# EAGLE design PygmyWEB_Performance_V1p1 (EAGLE 5.10)

## Sheet 1 of 6
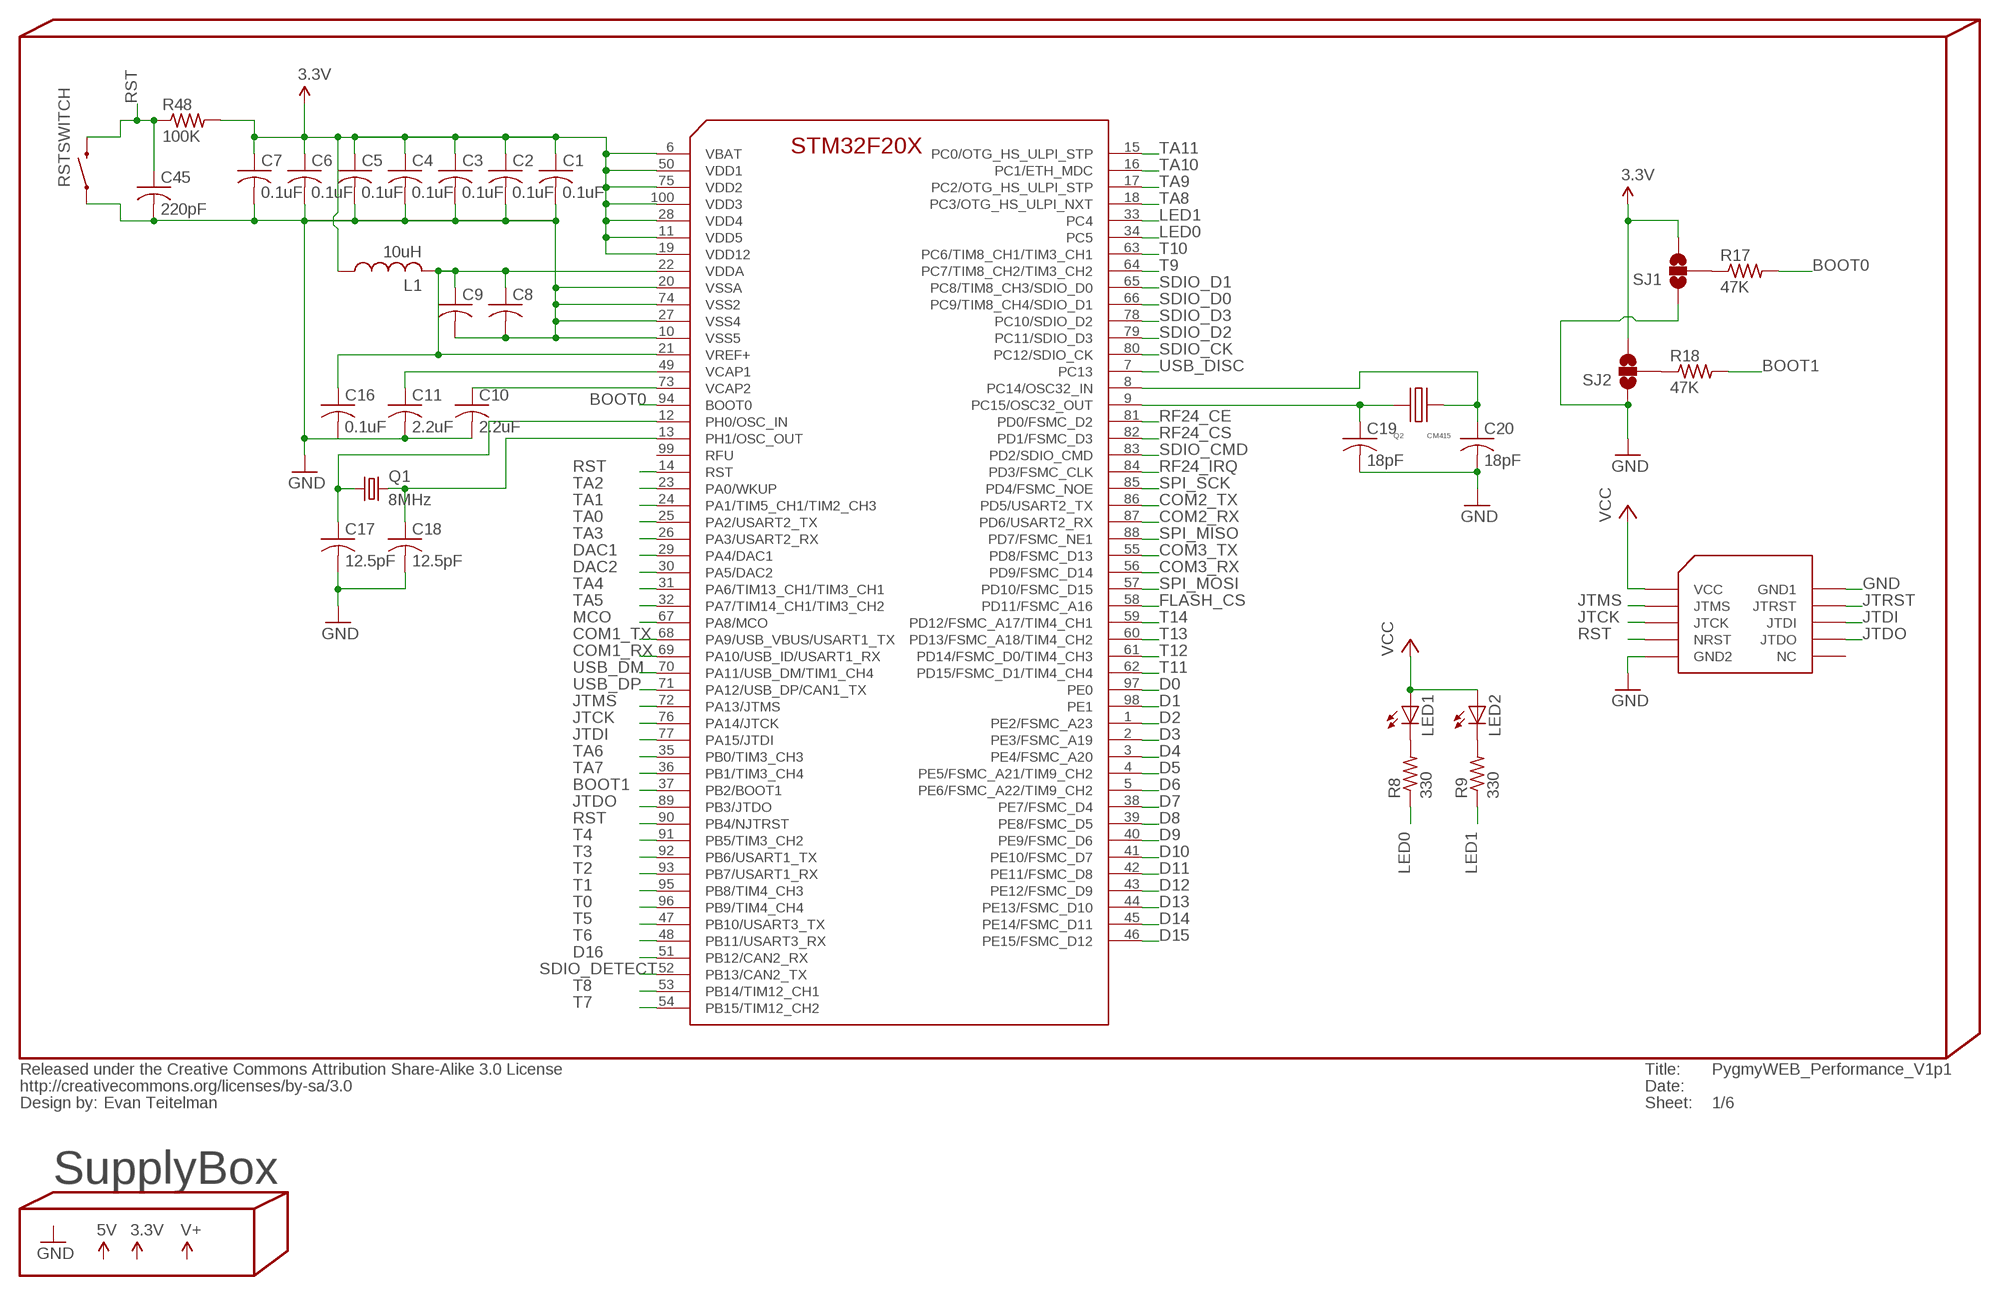
[diagram p0: schematic, sheet 1]

### Parts
C1  0.1uF  C-USC0402  [C0402]
C2  0.1uF  C-USC0402  [C0402]
C3  0.1uF  C-USC0402  [C0402]
C4  0.1uF  C-USC0402  [C0402]
C5  0.1uF  C-USC0402  [C0402]
C6  0.1uF  C-USC0402  [C0402]
C7  0.1uF  C-USC0402  [C0402]
C8  C-USC0402  [C0402]
C9  C-USC0402  [C0402]
C10  2.2uF  C-USC0402  [C0402]
C11  2.2uF  C-USC0402  [C0402]
C16  0.1uF  C-USC0402  [C0402]
C17  12.5pF  C-USC0402  [C0402]
C18  12.5pF  C-USC0402  [C0402]
C19  18pF  C-USC0402  [C0402]
C20  18pF  C-USC0402  [C0402]
C45  220pF  C-USC0402  [C0402]
CC1  Evan Teitelman  CC-BY-SA  [CC-BY-SA]
L1  10uH  L-USL1812  [L1812]
LED1  LED0603  [LED-0603]
LED2  LED0603  [LED-0603]
Q1  8MHz  CRYSTAL5X3  [CRYSTAL-SMD-5X3]
Q2  CM415  [CM415]
R8  330  R-US_R0402  [R0402]
R9  330  R-US_R0402  [R0402]
R17  47K  R-US_R0402  [R0402]
R18  47K  R-US_R0402  [R0402]
R48  100K  R-US_R0402  [R0402]
RSTSWITCH  SWITCH-MOMENTARY-2SMD  [TACTILE_SWITCH_SMD]
SJ1  SOLDERJUMPER_2WAYS  [SJ_3]
SJ2  SOLDERJUMPER_2WAYS  [SJ_3]
U1  STM32F205VG  [TQFP100]
U5  STM32-JTAG-10P  [STM32-JTAG-10P]

### Nets
3.3V: C1.1 C2.1 C3.1 C4.1 C5.1 C6.1 C7.1 L1.1 R48.2 SJ1.3 SJ2.3 U1.6(VBAT) U1.11(VDD5) U1.19(VDD12) U1.28(VDD4) U1.50(VDD1) U1.75(VDD2) U1.100(VDD3) ; also sheet 2,3,4,5
BOOT0: R17.2 U1.94(BOOT0) ; also sheet 3
BOOT1: R18.2 U1.37(PB2/BOOT1) ; also sheet 3
COM1_RX: U1.69(PA10/USB_ID/USART1_RX) ; also sheet 3
COM1_TX: U1.68(PA9/USB_VBUS/USART1_TX) ; also sheet 3
COM2_RX: U1.87(PD6/USART2_RX) ; also sheet 3
COM2_TX: U1.86(PD5/USART2_TX) ; also sheet 3
COM3_RX: U1.56(PD9/FSMC_D14) ; also sheet 3
COM3_TX: U1.55(PD8/FSMC_D13) ; also sheet 3
D0: U1.97(PE0) ; also sheet 3
D1: U1.98(PE1) ; also sheet 3
D2: U1.1(PE2/FSMC_A23) ; also sheet 3
D3: U1.2(PE3/FSMC_A19) ; also sheet 3
D4: U1.3(PE4/FSMC_A20) ; also sheet 3
D5: U1.4(PE5/FSMC_A21/TIM9_CH2) ; also sheet 3
D6: U1.5(PE6/FSMC_A22/TIM9_CH2) ; also sheet 3
D7: U1.38(PE7/FSMC_D4) ; also sheet 3
D8: U1.39(PE8/FSMC_D5) ; also sheet 3
D9: U1.40(PE9/FSMC_D6) ; also sheet 3
D10: U1.41(PE10/FSMC_D7) ; also sheet 3
D11: U1.42(PE11/FSMC_D8) ; also sheet 3
D12: U1.43(PE12/FSMC_D9) ; also sheet 3
D13: U1.44(PE13/FSMC_D10) ; also sheet 3
D14: U1.45(PE14/FSMC_D11) ; also sheet 3
D15: U1.46(PE15/FSMC_D12) ; also sheet 3
D16: U1.51(PB12/CAN2_RX) ; also sheet 3
DAC1: U1.29(PA4/DAC1) ; also sheet 3
DAC2: U1.30(PA5/DAC2) ; also sheet 3
FLASH_CS: U1.58(PD11/FSMC_A16)
GND: C1.2 C2.2 C3.2 C4.2 C5.2 C6.2 C7.2 C8.2 C9.2 C10.2 C11.2 C16.2 C17.2 C18.2 C19.2 C20.2 C45.2 RSTSWITCH.1 SJ1.1 SJ2.1 U1.10(VSS5) U1.20(VSSA) U1.27(VSS4) U1.74(VSS2) U5.P$2(GND1) U5.P$9(GND2) ; also sheet 2,3,4,5
JTCK: U1.76(PA14/JTCK) U5.P$5(JTCK) ; also sheet 3
JTDI: U1.77(PA15/JTDI) U5.P$6(JTDI) ; also sheet 3
JTDO: U1.89(PB3/JTDO) U5.P$8(JTDO) ; also sheet 3
JTMS: U1.72(PA13/JTMS) U5.P$3(JTMS) ; also sheet 3
JTRST: U5.P$4(JTRST) ; also sheet 3
LED0: R8.1 U1.34(PC5)
LED1: R9.1 U1.33(PC4)
MCO: U1.67(PA8/MCO) ; also sheet 3
N$1: C17.1 Q1.1 U1.12(PH0/OSC_IN)
N$2: C8.1 C9.1 C16.1 L1.2 U1.21(VREF+) U1.22(VDDA)
N$3: C18.1 Q1.3 U1.13(PH1/OSC_OUT)
N$6: C11.1 U1.49(VCAP1)
N$7: C10.1 U1.73(VCAP2)
N$8: C20.1 Q2.P$2(XOUT) U1.8(PC14/OSC32_IN)
N$9: C19.1 Q2.P$1(XIN) U1.9(PC15/OSC32_OUT)
N$10: LED1.C R8.2
N$12: LED2.C R9.2
N$30: R17.1 SJ1.2
N$31: R18.1 SJ2.2
RF24_CE: U1.81(PD0/FSMC_D2) ; also sheet 2
RF24_CS: U1.82(PD1/FSMC_D3) ; also sheet 2
RF24_IRQ: U1.84(PD3/FSMC_CLK) ; also sheet 2
RST: C45.1 R48.1 RSTSWITCH.3 U1.14(RST) U1.90(PB4/NJTRST) U5.P$7(NRST) ; also sheet 3
SDIO_CK: U1.80(PC12/SDIO_CK)
SDIO_CMD: U1.83(PD2/SDIO_CMD) ; also sheet 4
SDIO_D0: U1.66(PC9/TIM8_CH4/SDIO_D1) ; also sheet 4
SDIO_D1: U1.65(PC8/TIM8_CH3/SDIO_D0) ; also sheet 4
SDIO_D2: U1.79(PC11/SDIO_D3) ; also sheet 4
SDIO_D3: U1.78(PC10/SDIO_D2) ; also sheet 4
SDIO_DETECT: U1.52(PB13/CAN2_TX) ; also sheet 4
SPI_MISO: U1.88(PD7/FSMC_NE1) ; also sheet 2
SPI_MOSI: U1.57(PD10/FSMC_D15) ; also sheet 2
SPI_SCK: U1.85(PD4/FSMC_NOE) ; also sheet 2
T0: U1.96(PB9/TIM4_CH4) ; also sheet 3
T1: U1.95(PB8/TIM4_CH3) ; also sheet 3
T2: U1.93(PB7/USART1_RX) ; also sheet 3
T3: U1.92(PB6/USART1_TX) ; also sheet 3
T4: U1.91(PB5/TIM3_CH2) ; also sheet 3
T5: U1.47(PB10/USART3_TX) ; also sheet 3
T6: U1.48(PB11/USART3_RX) ; also sheet 3
T7: U1.54(PB15/TIM12_CH2) ; also sheet 3
T8: U1.53(PB14/TIM12_CH1) ; also sheet 3
T9: U1.64(PC7/TIM8_CH2/TIM3_CH2) ; also sheet 3
T10: U1.63(PC6/TIM8_CH1/TIM3_CH1) ; also sheet 3
T11: U1.62(PD15/FSMC_D1/TIM4_CH4) ; also sheet 3
T12: U1.61(PD14/FSMC_D0/TIM4_CH3) ; also sheet 3
T13: U1.60(PD13/FSMC_A18/TIM4_CH2) ; also sheet 3
T14: U1.59(PD12/FSMC_A17/TIM4_CH1) ; also sheet 3
TA0: U1.25(PA2/USART2_TX) ; also sheet 3
TA1: U1.24(PA1/TIM5_CH1/TIM2_CH3) ; also sheet 3
TA2: U1.23(PA0/WKUP) ; also sheet 3
TA3: U1.26(PA3/USART2_RX) ; also sheet 3
TA4: U1.31(PA6/TIM13_CH1/TIM3_CH1) ; also sheet 3
TA5: U1.32(PA7/TIM14_CH1/TIM3_CH2) ; also sheet 3
TA6: U1.35(PB0/TIM3_CH3) ; also sheet 3
TA7: U1.36(PB1/TIM3_CH4) ; also sheet 3
TA8: U1.18(PC3/OTG_HS_ULPI_NXT) ; also sheet 3
TA9: U1.17(PC2/OTG_HS_ULPI_STP) ; also sheet 3
TA10: U1.16(PC1/ETH_MDC) ; also sheet 3
TA11: U1.15(PC0/OTG_HS_ULPI_STP) ; also sheet 3
USB_DISC: U1.7(PC13) ; also sheet 3,4
USB_DM: U1.70(PA11/USB_DM/TIM1_CH4) ; also sheet 3,4
USB_DP: U1.71(PA12/USB_DP/CAN1_TX) ; also sheet 3,4
VCC: LED1.A LED2.A U5.P$1(VCC) ; also sheet 4
Unconnected: U1.99(RFU) U5.P$10(NC)

### Notes on the sheet
- SupplyBox

## Sheet 2 of 6
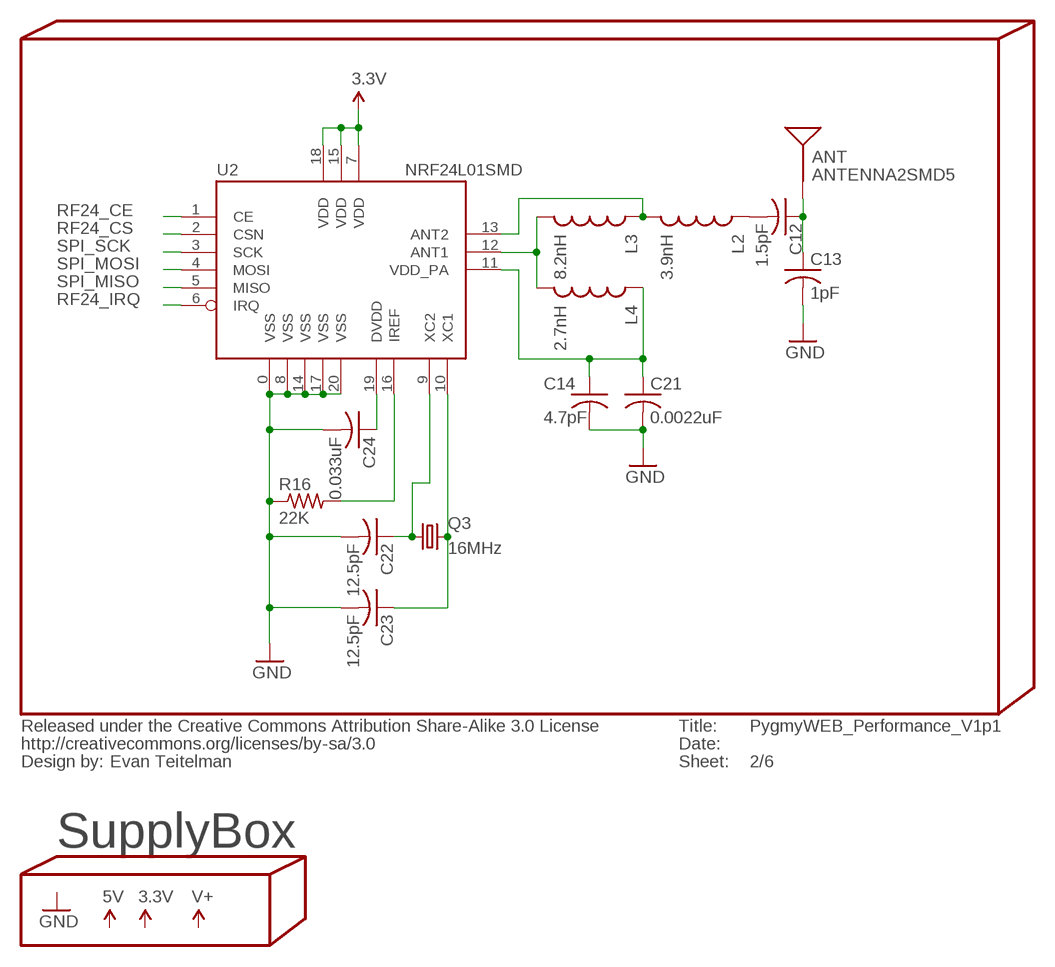
[diagram p1: schematic, sheet 2]

### Parts
ANT  ANTENNA2SMD5  [ANTENNA-CHIP5]
C12  1.5pF  C-USC0402  [C0402]
C13  1pF  C-USC0402  [C0402]
C14  4.7pF  C-USC0402  [C0402]
C21  0.0022uF  C-USC0402  [C0402]
C22  12.5pF  C-USC0402  [C0402]
C23  12.5pF  C-USC0402  [C0402]
C24  0.033uF  C-USC0402  [C0402]
L2  3.9nH  INDUCTOR0603  [0603]
L3  8.2nH  INDUCTOR0603  [0603]
L4  2.7nH  INDUCTOR0603  [0603]
Q3  16MHz  CRYSTAL5X3  [CRYSTAL-SMD-5X3]
R16  22K  R-US_R0402  [R0402]
U2  NRF24L01SMD  [QFN20]

### Nets
3.3V: U2.7(VDD) U2.15(VDD) U2.18(VDD) ; also sheet 1,3,4,5
GND: C13.2 C14.2 C21.2 C22.2 C23.2 C24.2 R16.1 U2.0(VSS) U2.8(VSS) U2.14(VSS) U2.17(VSS) U2.20(VSS) ; also sheet 1,3,4,5
N$17: C12.2 L2.1
N$18: L3.2 L4.2 U2.12(ANT1)
N$19: ANT.FEED(SIGNAL) C12.1 C13.1
N$20: L2.2 L3.1 U2.13(ANT2)
N$21: C14.1 C21.1 L4.1 U2.11(VDD_PA)
N$23: R16.2 U2.16(IREF)
N$24: C24.1 U2.19(DVDD)
N$26: C22.1 Q3.1 U2.9(XC2)
N$27: C23.1 Q3.3 U2.10(XC1)
RF24_CE: U2.1(CE) ; also sheet 1
RF24_CS: U2.2(CSN) ; also sheet 1
RF24_IRQ: U2.6(IRQ) ; also sheet 1
SPI_MISO: U2.5(MISO) ; also sheet 1
SPI_MOSI: U2.4(MOSI) ; also sheet 1
SPI_SCK: U2.3(SCK) ; also sheet 1

### Notes on the sheet
- SupplyBox

## Sheet 3 of 6
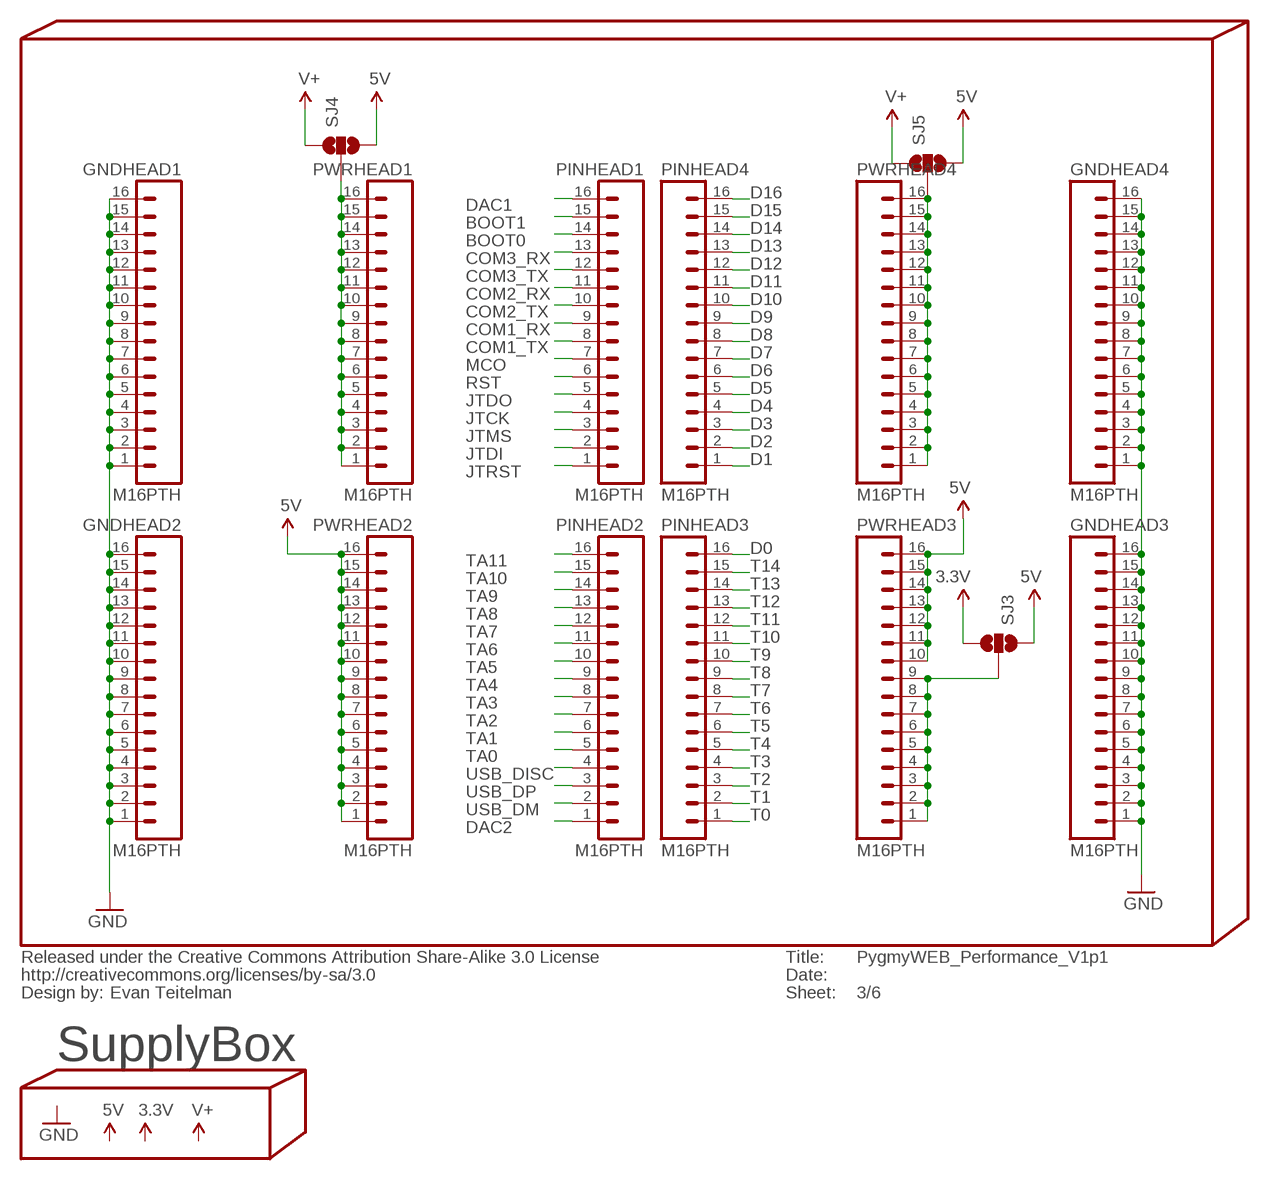
[diagram p2: schematic, sheet 3]

### Parts
GNDHEAD1  M16PTH  [1X16]
GNDHEAD2  M16PTH  [1X16]
GNDHEAD3  M16PTH  [1X16]
GNDHEAD4  M16PTH  [1X16]
PINHEAD1  M16PTH  [1X16]
PINHEAD2  M16PTH  [1X16]
PINHEAD3  M16PTH  [1X16]
PINHEAD4  M16PTH  [1X16]
PWRHEAD1  M16PTH  [1X16]
PWRHEAD2  M16PTH  [1X16]
PWRHEAD3  M16PTH  [1X16]
PWRHEAD4  M16PTH  [1X16]
SJ3  SOLDERJUMPER_2WAYPASTE1&2  [SJ_3_PASTE1&2]
SJ4  SOLDERJUMPER_2WAYPASTE1&2  [SJ_3_PASTE1&2]
SJ5  SOLDERJUMPER_2WAYPASTE1&2  [SJ_3_PASTE1&2]

### Nets
3.3V: SJ3.3 ; also sheet 1,2,4,5
5V: PWRHEAD2.1 PWRHEAD2.2 PWRHEAD2.3 PWRHEAD2.4 PWRHEAD2.5 PWRHEAD2.6 PWRHEAD2.7 PWRHEAD2.8 PWRHEAD2.9 PWRHEAD2.10 PWRHEAD2.11 PWRHEAD2.12 PWRHEAD2.13 PWRHEAD2.14 PWRHEAD2.15 PWRHEAD2.16 PWRHEAD3.10 PWRHEAD3.11 PWRHEAD3.12 PWRHEAD3.13 PWRHEAD3.14 PWRHEAD3.15 PWRHEAD3.16 SJ3.1 SJ4.3 SJ5.3 ; also sheet 4,5
BOOT0: PINHEAD1.14 ; also sheet 1
BOOT1: PINHEAD1.15 ; also sheet 1
COM1_RX: PINHEAD1.9 ; also sheet 1
COM1_TX: PINHEAD1.8 ; also sheet 1
COM2_RX: PINHEAD1.11 ; also sheet 1
COM2_TX: PINHEAD1.10 ; also sheet 1
COM3_RX: PINHEAD1.13 ; also sheet 1
COM3_TX: PINHEAD1.12 ; also sheet 1
D0: PINHEAD3.16 ; also sheet 1
D1: PINHEAD4.1 ; also sheet 1
D2: PINHEAD4.2 ; also sheet 1
D3: PINHEAD4.3 ; also sheet 1
D4: PINHEAD4.4 ; also sheet 1
D5: PINHEAD4.5 ; also sheet 1
D6: PINHEAD4.6 ; also sheet 1
D7: PINHEAD4.7 ; also sheet 1
D8: PINHEAD4.8 ; also sheet 1
D9: PINHEAD4.9 ; also sheet 1
D10: PINHEAD4.10 ; also sheet 1
D11: PINHEAD4.11 ; also sheet 1
D12: PINHEAD4.12 ; also sheet 1
D13: PINHEAD4.13 ; also sheet 1
D14: PINHEAD4.14 ; also sheet 1
D15: PINHEAD4.15 ; also sheet 1
D16: PINHEAD4.16 ; also sheet 1
DAC1: PINHEAD1.16 ; also sheet 1
DAC2: PINHEAD2.1 ; also sheet 1
GND: GNDHEAD1.1 GNDHEAD1.2 GNDHEAD1.3 GNDHEAD1.4 GNDHEAD1.5 GNDHEAD1.6 GNDHEAD1.7 GNDHEAD1.8 GNDHEAD1.9 GNDHEAD1.10 GNDHEAD1.11 GNDHEAD1.12 GNDHEAD1.13 GNDHEAD1.14 GNDHEAD1.15 GNDHEAD1.16 GNDHEAD2.1 GNDHEAD2.2 GNDHEAD2.3 GNDHEAD2.4 GNDHEAD2.5 GNDHEAD2.6 GNDHEAD2.7 GNDHEAD2.8 GNDHEAD2.9 GNDHEAD2.10 GNDHEAD2.11 GNDHEAD2.12 GNDHEAD2.13 GNDHEAD2.14 GNDHEAD2.15 GNDHEAD2.16 GNDHEAD3.1 GNDHEAD3.2 GNDHEAD3.3 GNDHEAD3.4 GNDHEAD3.5 GNDHEAD3.6 GNDHEAD3.7 GNDHEAD3.8 GNDHEAD3.9 GNDHEAD3.10 GNDHEAD3.11 GNDHEAD3.12 GNDHEAD3.13 GNDHEAD3.14 GNDHEAD3.15 GNDHEAD3.16 GNDHEAD4.1 GNDHEAD4.2 GNDHEAD4.3 GNDHEAD4.4 GNDHEAD4.5 GNDHEAD4.6 GNDHEAD4.7 GNDHEAD4.8 GNDHEAD4.9 GNDHEAD4.10 GNDHEAD4.11 GNDHEAD4.12 GNDHEAD4.13 GNDHEAD4.14 GNDHEAD4.15 GNDHEAD4.16 ; also sheet 1,2,4,5
JTCK: PINHEAD1.4 ; also sheet 1
JTDI: PINHEAD1.2 ; also sheet 1
JTDO: PINHEAD1.5 ; also sheet 1
JTMS: PINHEAD1.3 ; also sheet 1
JTRST: PINHEAD1.1 ; also sheet 1
MCO: PINHEAD1.7 ; also sheet 1
N$42: PWRHEAD3.1 PWRHEAD3.2 PWRHEAD3.3 PWRHEAD3.4 PWRHEAD3.5 PWRHEAD3.6 PWRHEAD3.7 PWRHEAD3.8 PWRHEAD3.9 SJ3.2
N$43: PWRHEAD1.1 PWRHEAD1.2 PWRHEAD1.3 PWRHEAD1.4 PWRHEAD1.5 PWRHEAD1.6 PWRHEAD1.7 PWRHEAD1.8 PWRHEAD1.9 PWRHEAD1.10 PWRHEAD1.11 PWRHEAD1.12 PWRHEAD1.13 PWRHEAD1.14 PWRHEAD1.15 PWRHEAD1.16 SJ4.2
N$45: PWRHEAD4.1 PWRHEAD4.2 PWRHEAD4.3 PWRHEAD4.4 PWRHEAD4.5 PWRHEAD4.6 PWRHEAD4.7 PWRHEAD4.8 PWRHEAD4.9 PWRHEAD4.10 PWRHEAD4.11 PWRHEAD4.12 PWRHEAD4.13 PWRHEAD4.14 PWRHEAD4.15 PWRHEAD4.16 SJ5.2
RST: PINHEAD1.6 ; also sheet 1
T0: PINHEAD3.1 ; also sheet 1
T1: PINHEAD3.2 ; also sheet 1
T2: PINHEAD3.3 ; also sheet 1
T3: PINHEAD3.4 ; also sheet 1
T4: PINHEAD3.5 ; also sheet 1
T5: PINHEAD3.6 ; also sheet 1
T6: PINHEAD3.7 ; also sheet 1
T7: PINHEAD3.8 ; also sheet 1
T8: PINHEAD3.9 ; also sheet 1
T9: PINHEAD3.10 ; also sheet 1
T10: PINHEAD3.11 ; also sheet 1
T11: PINHEAD3.12 ; also sheet 1
T12: PINHEAD3.13 ; also sheet 1
T13: PINHEAD3.14 ; also sheet 1
T14: PINHEAD3.15 ; also sheet 1
TA0: PINHEAD2.5 ; also sheet 1
TA1: PINHEAD2.6 ; also sheet 1
TA2: PINHEAD2.7 ; also sheet 1
TA3: PINHEAD2.8 ; also sheet 1
TA4: PINHEAD2.9 ; also sheet 1
TA5: PINHEAD2.10 ; also sheet 1
TA6: PINHEAD2.11 ; also sheet 1
TA7: PINHEAD2.12 ; also sheet 1
TA8: PINHEAD2.13 ; also sheet 1
TA9: PINHEAD2.14 ; also sheet 1
TA10: PINHEAD2.15 ; also sheet 1
TA11: PINHEAD2.16 ; also sheet 1
USB_DISC: PINHEAD2.4 ; also sheet 1,4
USB_DM: PINHEAD2.2 ; also sheet 1,4
USB_DP: PINHEAD2.3 ; also sheet 1,4
V+: SJ4.1 SJ5.1 ; also sheet 5

### Notes on the sheet
- SupplyBox

## Sheet 4 of 6
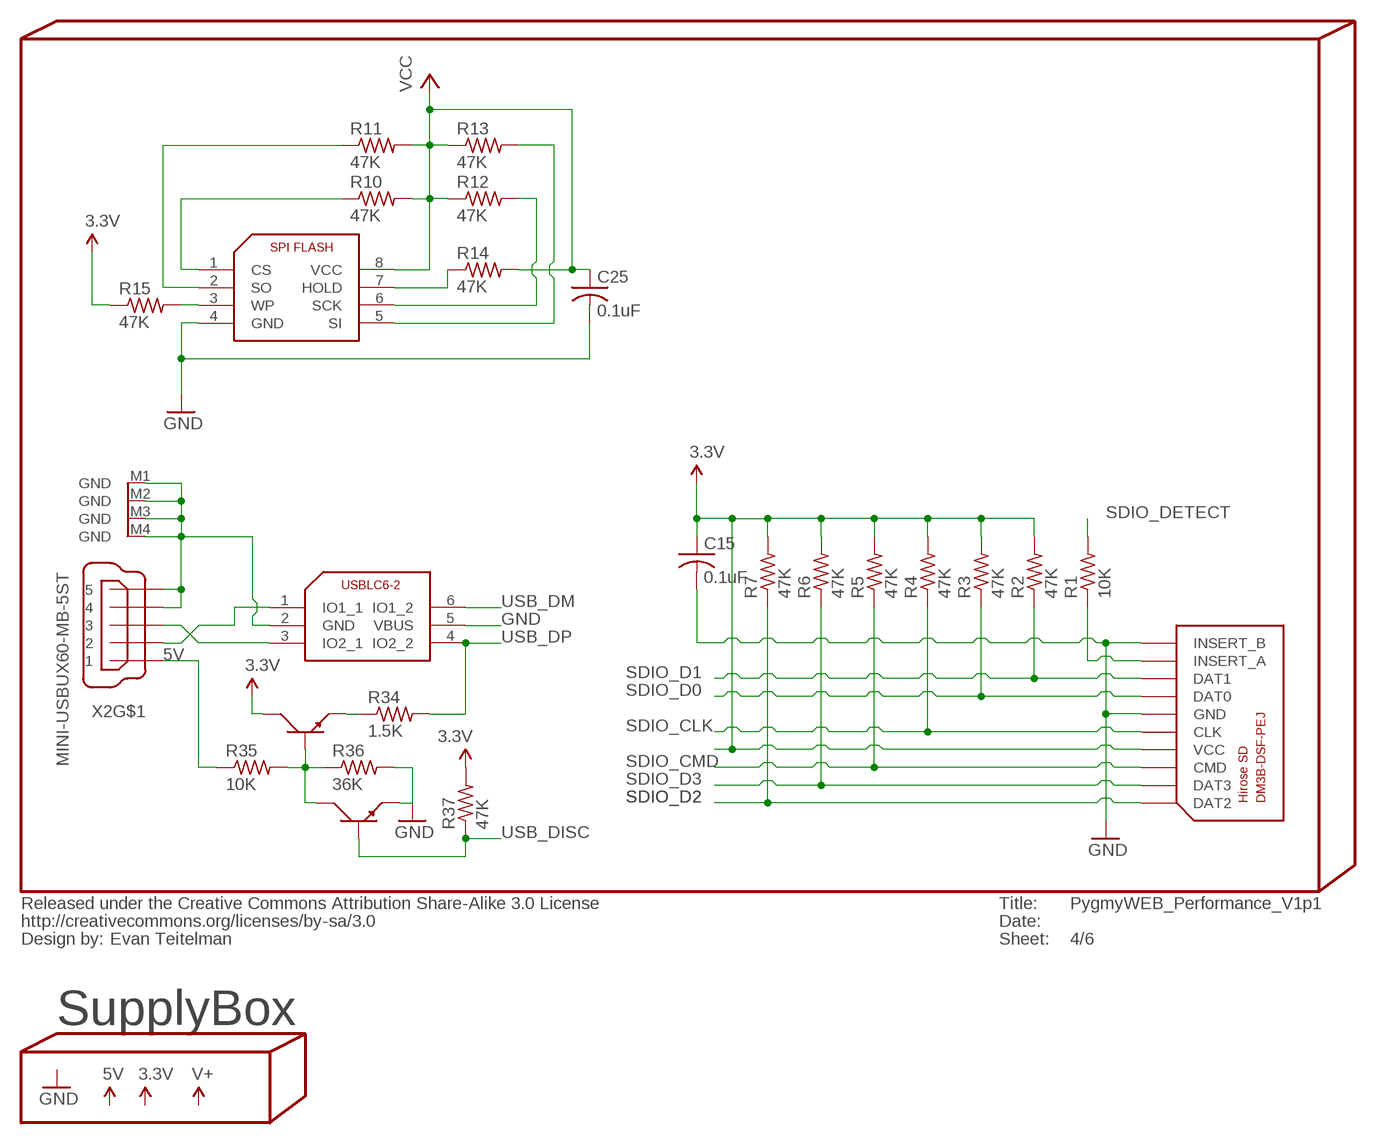
[diagram p3: schematic, sheet 4]

### Parts
C15  0.1uF  C-USC0402  [C0402]
C25  0.1uF  C-USC0402  [C0402]
R1  10K  R-US_R0402  [R0402]
R2  47K  R-US_R0402  [R0402]
R3  47K  R-US_R0402  [R0402]
R4  47K  R-US_R0402  [R0402]
R5  47K  R-US_R0402  [R0402]
R6  47K  R-US_R0402  [R0402]
R7  47K  R-US_R0402  [R0402]
R10  47K  R-US_R0402  [R0402]
R11  47K  R-US_R0402  [R0402]
R12  47K  R-US_R0402  [R0402]
R13  47K  R-US_R0402  [R0402]
R14  47K  R-US_R0402  [R0402]
R15  47K  R-US_R0402  [R0402]
R34  1.5K  R-US_R0402  [R0402]
R35  10K  R-US_R0402  [R0402]
R36  36K  R-US_R0402  [R0402]
R37  47K  R-US_R0402  [R0402]
U3  SST25VF080B  [DUBLIB_SOIC8]
U4  USBLC6-2  [SOT23-6L]
U6  HIROSE-SDCARD-DM3B-DSF-PEJ  [HIROSE-SDCARD-DM3B-DSF-PEJ]
U$23  PMBT6428  [SOT23]
U$24  PMBT6428  [SOT23]
X2  MINI-USBUX60-MB-5ST  [DUBLIB_UX60-MB-5ST]

### Nets
3.3V: C15.1 R2.2 R3.2 R4.2 R5.2 R6.2 R7.2 R15.1 R37.2 U6.P$4(VCC) U$23.3 ; also sheet 1,2,3,5
5V: R35.1 X2.1 ; also sheet 3,5
GND: C15.2 C25.2 R36.2 U3.4(GND) U4.2(GND) U4.5(VBUS) U6.P$6(GND) U6.P$11(INSERT_B) U$24.2 X2.4 X2.5 X2.M1(GND) X2.M2(GND) X2.M3(GND) X2.M4(GND) ; also sheet 1,2,3,5
N$4: R35.2 R36.1 U$23.1 U$24.3
N$11: R1.1 U6.P$9(INSERT_A)
N$13: R10.1 U3.1(CS)
N$14: R11.1 U3.2(SO)
N$15: R12.2 U3.6(SCK)
N$16: R13.2 U3.5(SI)
N$25: R34.1 U$23.2
N$28: R15.2 U3.3(WP)
N$29: R14.1 U3.7(HOLD)
N$38: U4.1(IO1_1) X2.2
SDIO_CLK: R4.1 U6.P$5(CLK)
SDIO_CMD: R5.1 U6.P$3(CMD) ; also sheet 1
SDIO_D0: R3.1 U6.P$7(DAT0) ; also sheet 1
SDIO_D1: R2.1 U6.P$8(DAT1) ; also sheet 1
SDIO_D2: R7.1 U6.P$1(DAT2) ; also sheet 1
SDIO_D3: R6.1 U6.P$2(DAT3) ; also sheet 1
SDIO_DETECT: R1.2 ; also sheet 1
USB_DISC: R37.1 U$24.1 ; also sheet 1,3
USB_DM: U4.6(IO1_2) ; also sheet 1,3
USB_DP: R34.2 U4.4(IO2_2) ; also sheet 1,3
USBP3: U4.3(IO2_1) X2.3
VCC: C25.1 R10.2 R11.2 R12.1 R13.1 R14.2 U3.8(VCC) ; also sheet 1

### Notes on the sheet
- SupplyBox

## Sheet 5 of 6
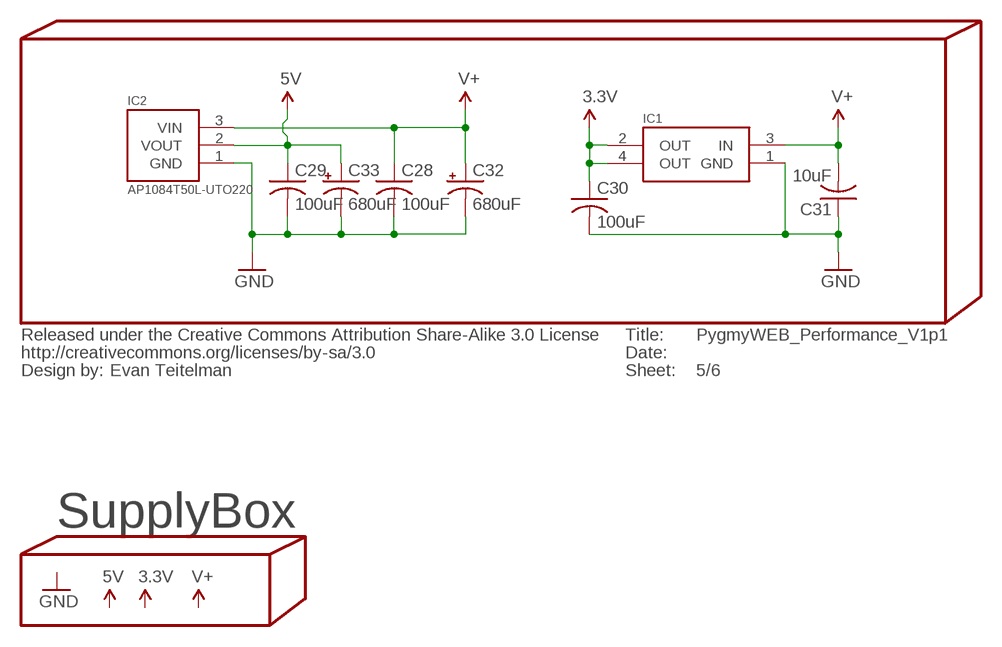
[diagram p4: schematic, sheet 5]

### Parts
C28  100uF  C-USC0402  [C0402]
C29  100uF  C-USC0402  [C0402]
C30  100uF  C-USC0402  [C0402]
C31  10uF  C-USC0402  [C0402]
C32  680uF  CAP_POLD  [PANASONIC_D]
C33  680uF  CAP_POLD  [PANASONIC_D]
IC1  TLV111  [SOT223]
IC2  AP1084T50L-UTO220  [TO220V]

### Nets
3.3V: C30.1 IC1.2(OUT) IC1.4(OUT) ; also sheet 1,2,3,4
5V: C29.1 C33.+ IC2.2(VOUT) ; also sheet 3,4
GND: C28.2 C29.2 C30.2 C31.1 C32.- C33.- IC1.1(GND) IC2.1(GND) ; also sheet 1,2,3,4
V+: C28.1 C31.2 C32.+ IC1.3(IN) IC2.3(VIN) ; also sheet 3

### Notes on the sheet
- SupplyBox

## Sheet 6 of 6
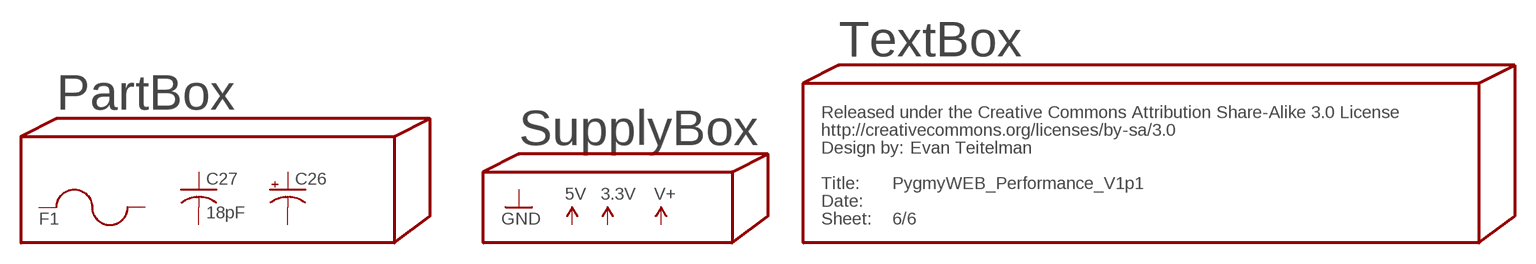
[diagram p5: schematic, sheet 6]

### Parts
C26  CAP_POLD  [PANASONIC_D]
C27  18pF  C-USC0402  [C0402]
F1  BOURNES-PTC-MF-SMXXXMF-SM150  [MF-SM150]
Unconnected: C26.+ C26.- C27.1 C27.2 F1.P$1 F1.P$2

### Notes on the sheet
- TextBox
- PartBox
- SupplyBox

## Power pins joined to a net without a drawn wire
GND: U6.P$12(GND) U6.P$13(GND) U6.P$14(GND)

## Library data of the parts
ANT = Pygmy:ANTENNA2: Antenna Single endded antenna. Common with smaller chip antennas. CHIP4 package is the GPS Chip Antenna SKU: GPS-08418. CHIP5 package is 2.4GHz chip antenna SKU: WRL-00144.
C1-C25 C27-C31 C45 = rcl:C-US: CAPACITOR, American symbol
C26 C32 C33 = SparkFun:CAP_POL: Capacitor Polarized These are standard SMD and PTH capacitors. Normally 10uF, 47uF, and 100uF in electrolytic and tantalum varieties. Always verify the external diameter of the through hole cap, it varies with capacity, voltage, and manufacturer. The EIA devices should be standard.
CC1 = Custom12:CC-BY-SA: Creative Commons Attribution-ShareAlike License <http://creativecommons.org/licenses/by-sa/3.0/>
F1 = Pygmy:BOURNES-PTC-MF-SMXXX
GNDHEAD1-GNDHEAD4 PINHEAD1-PINHEAD4 PWRHEAD1-PWRHEAD4 = Pygmy:M16
IC1 = Custom12:TLV111
IC2 = Custom12:AP1084T50L-U
L1 = rcl:L-US: INDUCTOR, American symbol
L2-L4 = Pygmy:INDUCTOR: Inductors Basic Inductor/Choke - 0603 and 1206. Footprints are not proven and vary greatly between part numbers.
LED1 LED2 = Pygmy:LED: LEDs Standard schematic elements and footprints for 5mm, 3mm, 1206, and 0603 sized LEDs. 5mm - Spark Fun Electronics SKU : COM-00529 (and others)
Q1 Q3 = Pygmy:CRYSTAL: Crystals Various standard crystals. Proven footprints. Spark Fun Electronics SKU : COM-00534
Q2 = Pygmy:CM415
R1-R18 R34-R37 R48 = rcl:R-US_: RESISTOR, American symbol
RSTSWITCH = SparkFun:SWITCH-MOMENTARY-2
SJ1 SJ2 = Pygmy:SOLDERJUMPER_2WAY: Solder Jumper 2 way solder jumper
SJ3-SJ5 = SparkFun:SOLDERJUMPER_2WAY: Solder Jumper 2 way solder jumper
U1 = Pygmy:STM32F205VG
U2 = Pygmy:NRF24L01: 2.4GHz Low Power Transceiver This is the very popular, low cost, very low power RF transceiver from Nordic Semiconductor. Simple SPI interface. SKU: COM-00690
U3 = Pygmy:SST25VF080B
U4 = Pygmy:USBLC6-2
U5 = Pygmy:STM32-JTAG-10P
U6 = Pygmy:HIROSE-SDCARD-DM3B-DSF-PEJ
U$23 U$24 = dublib:PMBT6428
X2 = Pygmy:MINI-USB: MINI USB Connector Source: http://www.hirose.co.jp/cataloge_hp/e24000019.pdf

## Board
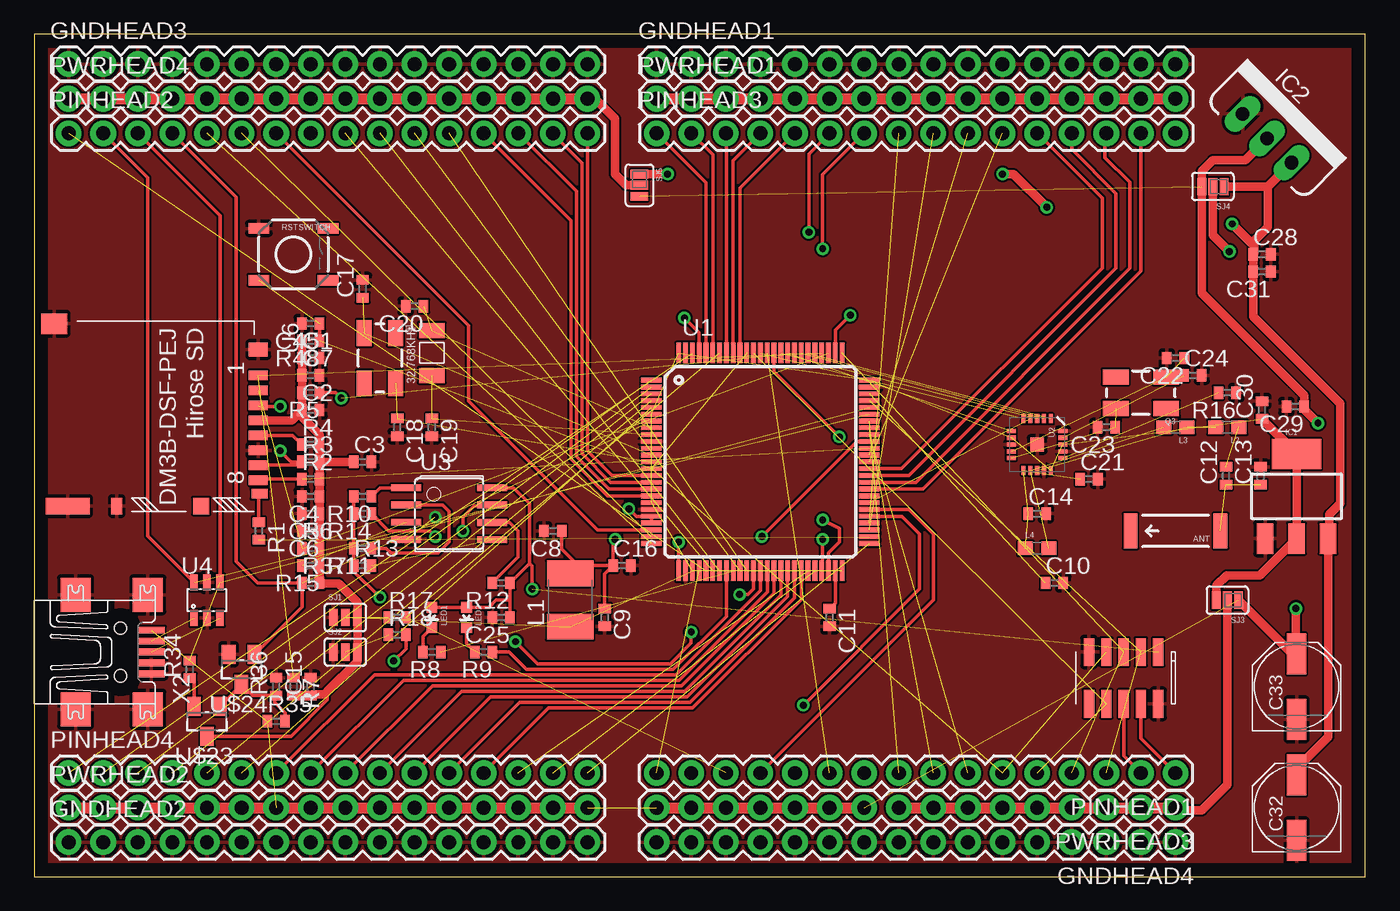
[diagram p6: board, top side]
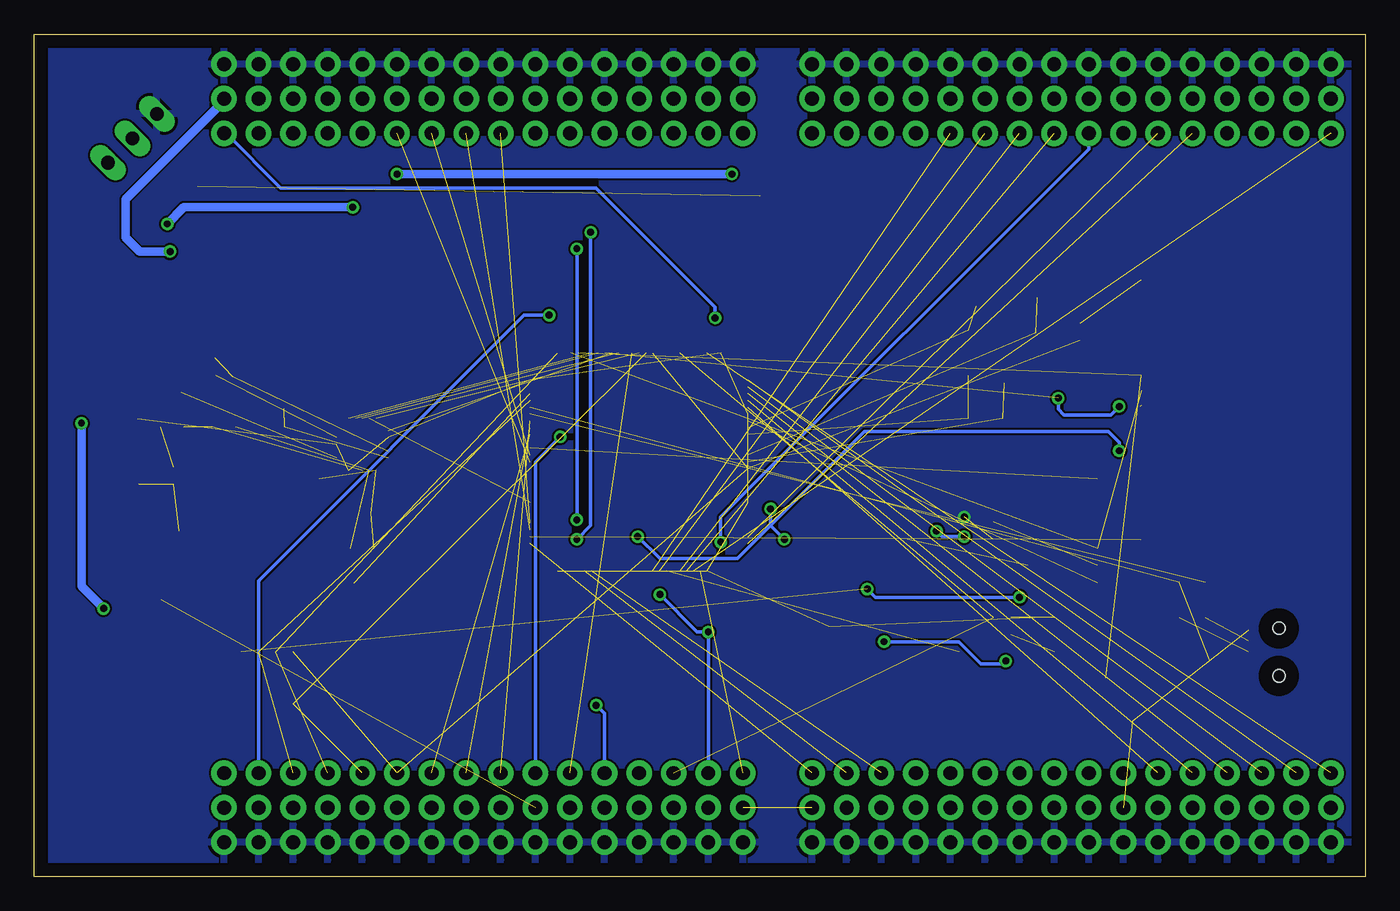
[diagram p7: board, bottom side, seen from below]

Size 97.77 x 61.9 mm. Coordinates in mm from the lower left corner, seen from the top.
Outline: 0,0 97.77,0 97.77,61.9 0,61.9 0,0
Copper layers (1*16): Top 0.035mm / dielectric 1.5mm / Bottom 0.035mm
Design rules "default *": minimum track width 10mil, minimum drill 24mil, track to track 6mil, track to pad 8mil, pad to pad 8mil, via to via 8mil, smd to smd 8mil, copper to edge 40mil, drill to drill 8mil, minimum pad ring 10mil, minimum via ring 8mil, stop-mask expansion 4mil, vias tented up to drill 0mil, thermal gap 10mil

### Footprints (pad centres in the part's own frame; a part is rotated, then mirrored left to right if it is on the bottom)
ANTENNA-CHIP5 = smd 1.016 x 2.54: FEED -3.302,0; NC 3.302,0
C0402 = smd 0.7 x 0.9: 1 -0.65,0; 2 0.65,0
PANASONIC_D = smd 3 x 1.4: + 2.4,0; - -2.4,0
MF-SM150 = smd 4.2 x 4.6: P$1 0,0; P$2 6.5,0
1X16 = drill 1.016 pad 1.88 round: 1 0,0; 2 2.54,0; 3 5.08,0; 4 7.62,0; 5 10.16,0; 6 12.7,0; 7 15.24,0; 8 17.78,0; 9 20.32,0; 10 22.86,0; 11 25.4,0; 12 27.94,0; 13 30.48,0; 14 33.02,0; 15 35.56,0; 16 38.1,0
SOT223 = smd 1.219 x 2.235: 1 -2.311,-3.099; 2 0,-3.099; 3 2.311,-3.099 | smd 3.6 x 2.2: 4 0,3.099
TO220V = drill 1.016 long: 1 -2.54,0; 2 0,0; 3 2.54,0
L1812 = smd 1.9 x 3.4: 1 -1.95,0; 2 1.95,0
0603 = smd 1.1 x 1: 1 -0.85,0; 2 0.85,0
LED-0603 = smd 0.8 x 0.8: A 0,-0.75; C 0,0.75
CRYSTAL-SMD-5X3 = smd 1.9 x 1.1: 1 -1.85,-1.15; 2 1.85,-1.15; 3 1.85,1.15; 4 -1.85,1.15
CM415 = smd 1.1 x 1.9: P$1 0,0; P$2 3.3,0
R0402 = smd 0.7 x 0.9: 1 -0.65,0; 2 0.65,0
TACTILE_SWITCH_SMD = smd 1.524 x 0.762: 1 -2.54,1.905; 2 2.54,1.905; 3 -2.54,-1.905; 4 2.54,-1.905
SJ_3 = smd 0.635 x 1.27: 1 -0.889,0; 2 0,0; 3 0.889,0
SJ_3_PASTE1&2 = smd 0.635 x 1.27: 1 -0.813,0; 2 0,0; 3 0.813,0
TQFP100 = smd 1.5 x 0.35: 1 -8,6; 2 -8,5.5; 3 -8,5; 4 -8,4.5; 5 -8,4; 6 -8,3.5; 7 -8,3; 8 -8,2.5; 9 -8,2; 10 -8,1.5; 11 -8,1; 12 -8,0.5; 13 -8,0; 14 -8,-0.5; 15 -8,-1; 16 -8,-1.5; 17 -8,-2; 18 -8,-2.5; 19 -8,-3; 20 -8,-3.5; 21 -8,-4; 22 -8,-4.5; 23 -8,-5; 24 -8,-5.5; 25 -8,-6; 51 8,-6; 52 8,-5.5; 53 8,-5; 54 8,-4.5; 55 8,-4; 56 8,-3.5; 57 8,-3; 58 8,-2.5; 59 8,-2; 60 8,-1.5; 61 8,-1; 62 8,-0.5; 63 8,0; 64 8,0.5; 65 8,1; 66 8,1.5; 67 8,2; 68 8,2.5; 69 8,3; 70 8,3.5; 71 8,4; 72 8,4.5; 73 8,5; 74 8,5.5; 75 8,6 | smd 0.35 x 1.5: 26 -6,-8; 27 -5.5,-8; 28 -5,-8; 29 -4.5,-8; 30 -4,-8; 31 -3.5,-8; 32 -3,-8; 33 -2.5,-8; 34 -2,-8; 35 -1.5,-8; 36 -1,-8; 37 -0.5,-8; 38 0,-8; 39 0.5,-8; 40 1,-8; 41 1.5,-8; 42 2,-8; 43 2.5,-8; 44 3,-8; 45 3.5,-8; 46 4,-8; 47 4.5,-8; 48 5,-8; 49 5.5,-8; 50 6,-8; 76 6,8; 77 5.5,8; 78 5,8; 79 4.5,8; 80 4,8; 81 3.5,8; 82 3,8; 83 2.5,8; 84 2,8; 85 1.5,8; 86 1,8; 87 0.5,8; 88 0,8; 89 -0.5,8; 90 -1,8; 91 -1.5,8; 92 -2,8; 93 -2.5,8; 94 -3,8; 95 -3.5,8; 96 -4,8; 97 -4.5,8; 98 -5,8; 99 -5.5,8; 100 -6,8
QFN20 = smd 1 x 1: 0 0,0 | smd 0.65 x 0.3: 1 -1.9,1; 2 -1.9,0.5; 3 -1.9,0; 4 -1.9,-0.5; 5 -1.9,-1; 11 1.9,-1; 12 1.9,-0.5; 13 1.9,0; 14 1.9,0.5; 15 1.9,1 | smd 0.3 x 0.65: 6 -1,-1.9; 7 -0.5,-1.9; 8 0,-1.9; 9 0.5,-1.9; 10 1,-1.9; 16 1,1.9; 17 0.5,1.9; 18 0,1.9; 19 -0.5,1.9; 20 -1,1.9
DUBLIB_SOIC8 = smd 0.5 x 2.2: 1 -1.905,-3.154; 2 -0.645,-3.154; 3 0.625,-3.154; 4 1.895,-3.154; 5 1.905,3.154; 6 0.635,3.154; 7 -0.635,3.154; 8 -1.905,3.154
SOT23-6L = smd 0.55 x 1.2: 1 -0.95,-1.3; 2 0,-1.3; 3 0.95,-1.3; 4 0.95,1.3; 5 0,1.3; 6 -0.95,1.3
STM32-JTAG-10P = smd 0.762 x 2.032: P$1 0,0; P$2 0,3.81; P$3 1.27,0; P$4 1.27,3.81; P$5 2.54,0; P$6 2.54,3.81; P$7 3.81,0; P$8 3.81,3.81; P$9 5.08,0; P$10 5.08,3.81
HIROSE-SDCARD-DM3B-DSF-PEJ = smd 0.7 x 1.4: P$1 0,-0.7; P$2 1.1,-0.7; P$3 2.2,-0.7; P$4 3.3,-0.7; P$5 4.4,-0.7; P$6 5.5,-0.7; P$7 6.6,-0.7; P$8 7.7,-0.7 | smd 0.7 x 1.2: P$9 8.7,-0.6 | smd 1.2 x 1.2: P$10 9.6,-4.9 | smd 1.2 x 0.8: P$11 9.6,-11.1 | smd 1.2 x 3.2: P$12 9.6,-14.7 | smd 1.5 x 1.9: P$13 -3.8,-15.7 | smd 1 x 1.4: P$14 -1.9,-0.7
SOT23@1 = smd 1 x 1.4: 1 -0.95,-1.1; 2 0.95,-1.1; 3 0,1.1
DUBLIB_UX60-MB-5ST = smd 2 x 0.5: 1 2.25,1.6; 2 2.25,0.8; 3 2.25,0; 4 2.25,-0.8; 5 2.25,-1.6 | smd 2.2 x 2.5: M1 -3.3,-4.2; M2 -3.3,4.2; M3 2,4.2; M4 2,-4.2 | hole 0.9: 0,-1.75; 0,1.75

### Placement (x,y rotation side)
ANT  83.82,25.4 180 top
C1  20.32,38.1 0 top
C2  20.32,34.29 0 top
C3  24.13,30.48 0 top
C4  20.32,27.94 180 top
C5  20.32,26.67 180 top
C6  20.32,25.4 180 top
C7  20.32,36.83 0 top
C8  38.1,25.4 180 top
C9  41.91,19.05 270 top
C10  74.93,21.59 0 top
C11  58.42,19.05 270 top
C12  87.53,29.46 90 top
C13  90.07,29.46 90 top
C14  73.66,26.67 0 top
C15  20.32,13.97 90 top
C16  43.18,22.86 0 top
C17  24.13,43.18 90 top
C18  26.67,33.02 270 top
C19  29.21,33.02 270 top
C20  27.94,41.91 180 top
C21  77.47,29.21 0 top
C22  83.82,38.1 180 top
C23  78.74,33.02 180 top
C24  85.09,36.83 0 top
C25  34.29,19.05 180 top
C26  -55.88,76.2 0 top  (outside the outline)
C27  -52.07,53.34 0 top  (outside the outline)
C28  90.17,45.72 0 top
C29  92.61,34.54 180 top
C30  90.17,34.29 90 top
C31  90.17,44.45 180 top
C32  92.71,5.08 90 top
C33  92.71,13.97 90 top
C45  20.32,40.64 180 top
CC1  0,-7.62 0 top  (outside the outline)
F1  -45.72,59.69 0 top  (outside the outline)
GNDHEAD1  45.72,59.69 0 top
GNDHEAD2  2.54,2.54 0 top
GNDHEAD3  2.54,59.69 0 top
GNDHEAD4  83.82,2.54 180 top
IC1  92.71,27.94 0 top
IC2  90.54,54.24 315 top
L1  39.37,20.32 90 top
L2  87.63,33.02 180 top
L3  83.82,33.02 180 top
L4  73.66,24.13 0 top
LED1  29.21,19.05 180 top
LED2  31.75,19.05 180 top
PINHEAD1  83.82,7.62 180 top
PINHEAD2  2.54,54.61 0 top
PINHEAD3  45.72,54.61 0 top
PINHEAD4  2.54,7.62 0 top
PWRHEAD1  45.72,57.15 0 top
PWRHEAD2  2.54,5.08 0 top
PWRHEAD3  83.82,5.08 180 top
PWRHEAD4  2.54,57.15 0 top
Q1  25.4,38.1 270 top
Q2  29.21,36.83 90 top
Q3  81.28,35.56 180 top
R1  16.51,25.4 270 top
R2  20.32,29.21 0 top
R3  20.32,30.48 0 top
R4  20.32,31.75 0 top
R5  20.32,35.56 180 top
R6  20.32,24.13 0 top
R7  19.05,13.97 270 top
R8  29.21,16.51 180 top
R9  33.02,16.51 180 top
R10  24.13,27.94 180 top
R11  24.13,24.13 180 top
R12  34.29,21.59 180 top
R13  24.13,22.86 0 top
R14  24.13,26.67 180 top
R15  20.32,22.86 180 top
R16  87.63,35.56 180 top
R17  26.67,19.05 0 top
R18  26.67,17.78 0 top
R34  11.43,15.24 90 top
R35  17.78,11.43 0 top
R36  17.78,13.97 90 top
R37  20.32,21.59 0 top
R48  20.32,39.37 180 top
RSTSWITCH  19.05,45.72 0 top
SJ1  22.86,19.05 0 top
SJ2  22.86,16.51 0 top
SJ3  87.63,20.32 180 top
SJ4  86.56,50.7 180 top
SJ5  44.45,50.8 270 top
U1  53.34,30.48 0 top
U2  73.66,31.75 270 top
U3  30.48,26.67 270 top
U4  12.7,20.32 0 top
U5  82.55,16.51 180 top
U6  17.17,36.83 270 top
U$23  PMBT6428  [SOT23@1]  12.7,11.43 180 top
U$24  PMBT6428  [SOT23@1]  15.24,15.24 180 top
X2  6.35,16.51 0 top

### Tracks (layer width: path | path; a pad name or v marks a point on that pad's centre or on a via)
3.3V  (12 unrouted)
  Top 0.254: 19.71,33.73 19.71,34.25 C2.1 | U$23.3 18.86,10.33 21.54,13.01 21.54,13.61
  Top 0.61: R3.2 R2.2 C4.1 C5.1 C6.1 R6.2 R15.1 R37.2 21.02,21.54 22.35,21.54 23.75,20.14 SJ1.3 SJ2.3 23.75,15.82 21.54,13.61 21.34,13.41 20.41,13.41 C15.1 R7.2 | R3.2 R4.2 20.97,32.47 19.71,33.73 | R48.2 C1.1 C7.1 R5.2 C2.1 | R3.2 C3.1 | C2.1 18.9,33.53 U6.P$4 | SJ3.3 86.82,21.39 87.58,22.15 90.02,22.15 IC1.2 IC1.4 92.71,31.1 C30.1
5V  (via drill 0.51)  (5 unrouted)
  Top 0.61: IC2.2 88.93,52.63 86.56,52.63 85.75,51.82 SJ4.3 85.75,42.88 93.27,35.36 93.27,34.55 C29.1 93.26,34.35 v94.28,33.33 | SJ3.1 92.39,16.37 C33.+ 92.66,16.42 v92.66,19.71
  Top 0.813: PWRHEAD2.16 PWRHEAD2.15 PWRHEAD2.14 PWRHEAD2.13 PWRHEAD2.12 PWRHEAD2.11 PWRHEAD2.10 PWRHEAD2.9 PWRHEAD2.8 PWRHEAD2.7 PWRHEAD2.6 PWRHEAD2.5 PWRHEAD2.4 PWRHEAD2.3 PWRHEAD2.2 PWRHEAD2.1 | PWRHEAD3.10 PWRHEAD3.11 PWRHEAD3.12 PWRHEAD3.13 PWRHEAD3.14 PWRHEAD3.15 PWRHEAD3.16
  Bottom 0.61: v94.28,33.33 94.28,21.34 v92.66,19.71
BOOT0  (2 unrouted)
BOOT1  (via drill 0.51)
  Top 0.254: U1.37 52.83,21.13 52.43,20.73 v51.82,20.73 | v26.42,15.85 27.32,16.75 R18.2 | v48.26,17.98 48.26,17.17 46.74,15.65 36.98,15.65 v35.36,17.27
  Bottom 0.254: PINHEAD1.15 v48.26,17.98 49.07,17.98 v51.82,20.73 | v35.36,17.27 29.87,17.27 28.25,15.65 26.62,15.65 v26.42,15.85
COM1_RX  (1 unrouted)
COM1_TX  (1 unrouted)
COM2_RX  (1 unrouted)
COM2_TX  (via drill 0.51)
  Top 0.254: U1.86 54.34,37.1 v59.13,32.31
  Bottom 0.254: v59.13,32.31 60.96,30.48 PINHEAD1.10
COM3_RX
  Top 0.254: U1.56 64.26,26.98 66.04,25.2 66.04,20.32 PINHEAD1.13
COM3_TX  (via drill 0.51)
  Top 0.254: U1.55 63.74,26.48 65.02,25.2 65.02,21.13 v56.49,12.6
  Bottom 0.254: v56.49,12.6 55.88,11.99 PINHEAD1.12
D0  (via drill 0.51)
  Top 0.254: U1.97 48.84,39.96 v47.75,41.05
  Bottom 0.254: v47.75,41.05 47.75,41.86 56.49,50.6 79.65,50.6 83.67,54.61 PINHEAD3.16
D1  (1 unrouted)
D2  (1 unrouted)
D3  (1 unrouted)
D4  (1 unrouted)
D5  (1 unrouted)
D6  (1 unrouted)
D7
  Top 0.254: U1.38 53.34,21.03 47.14,14.83 24.99,14.83 PINHEAD4.7
D8
  Top 0.254: U1.39 53.84,20.92 47.35,14.43 27.13,14.43 PINHEAD4.8
D9
  Top 0.254: U1.40 54.34,20.81 47.55,14.02 29.26,14.02 PINHEAD4.9
D10
  Top 0.254: U1.41 54.84,20.7 47.75,13.61 31.39,13.61 PINHEAD4.10
D11
  Top 0.254: U1.42 55.34,20.59 47.95,13.21 33.53,13.21 PINHEAD4.11
D12
  Top 0.254: U1.43 55.84,20.48 48.16,12.8 35.66,12.8 PINHEAD4.12
D13
  Top 0.254: U1.44 56.34,20.37 48.36,12.39 37.8,12.39 PINHEAD4.13
D14  (1 unrouted)
D15  (1 unrouted)
D16  (1 unrouted)
DAC1  (1 unrouted)
DAC2  (1 unrouted)
GND  (via drill 0.51)  (1 unrouted)
  other vias: 29.46,26.42
  pour Bottom: 0,62.23 97.79,62.23 97.79,0 0,0
  pour Top: 0,62.23 97.79,62.23 97.79,0 0,0
JTCK  (2 unrouted)
JTDI  (via drill 0.51)
  Top 0.254: U1.77 58.84,40.15 v59.94,41.25 | PINHEAD1.2 80.01,8.89 U5.P$6
  Bottom 0.254: v59.94,41.25 61.77,41.25 81.28,21.74 PINHEAD1.2
JTDO  (2 unrouted)
JTMS  (2 unrouted)
JTRST
  Top 0.254: PINHEAD1.1 81.28,10.16 U5.P$4
LED0  (1 unrouted)
LED1
  Top 0.254: R9.1 34.9,16.51 36.17,15.24 46.94,15.24 50.84,19.14 U1.33
MCO  (1 unrouted)
N$1  (2 unrouted)
N$2  (via drill 0.51)
  Top 0.254: C9.1 41.91,22.24 C16.1 | 39.96,22.86 C16.1 | L1.2 39.96,22.86 | C16.1 42.53,24.65 v42.67,24.79 | v43.69,27.03 44.23,26.48 U1.21 U1.22 | 39.96,22.86 38.75,24.07 C8.1
  Bottom 0.254: v42.67,24.79 43.69,25.81 v43.69,27.03
N$3  (2 unrouted)
N$4
  Top 0.254: R35.2 18.43,12.05 17.68,12.8 17.68,13.22 R36.1 16.06,13.32 U$24.3 15.24,14.12 U$23.1
N$6
  Top 0.254: C11.1 58.84,20.12 U1.49
N$7  (1 unrouted)
N$8  (2 unrouted)
N$9  (2 unrouted)
N$10
  Top 0.254: R8.2 28.56,17.65 LED1.C
N$11
  Top 0.254: R1.1 16.51,28.07 U6.P$9
N$12
  Top 0.254: R9.2 31.75,17.13 LED2.C
N$13
  Top 0.254: U3.1 25.41,28.57 R10.1
N$14
  Top 0.254: R11.1 25.86,24.13 26.21,23.77 29.67,23.77 30.48,24.59 30.48,26.82 29.99,27.32 U3.2
N$15
  Top 0.254: R12.2 35.56,23.51 35.56,25.4 34.92,26.04 U3.6
N$16  (1 unrouted)
N$17  (1 unrouted)
N$18  (2 unrouted)
N$19  (2 unrouted)
N$20  (2 unrouted)
N$21  (3 unrouted)
N$23  (1 unrouted)
N$24  (1 unrouted)
N$25
  Top 0.254: U$23.2 11.75,14.27 R34.1
N$26  (2 unrouted)
N$27  (2 unrouted)
N$28  (1 unrouted)
N$29  (via drill 0.51)
  Top 0.254: U3.7 33.56,27.23 32.31,27.23 31.5,26.42 v31.5,25.4 | v29.46,24.99 29.06,25.4 26.05,25.4 R14.1
  Bottom 0.254: v31.5,25.4 31.09,24.99 v29.46,24.99
N$30  (1 unrouted)
N$31  (1 unrouted)
N$38  (1 unrouted)
N$42
  Top 0.61: SJ3.2 87.63,6.76 85.75,4.88 84.02,4.88 PWRHEAD3.1
  Top 0.813: PWRHEAD3.9 PWRHEAD3.8 PWRHEAD3.7 PWRHEAD3.6 PWRHEAD3.5 PWRHEAD3.4 PWRHEAD3.3 PWRHEAD3.2 PWRHEAD3.1
N$43  (via drill 0.51)
  Top 0.61: SJ4.2 86.56,47.14 v87.78,45.92
  Top 0.813: PWRHEAD1.1 PWRHEAD1.2 PWRHEAD1.3 PWRHEAD1.4 PWRHEAD1.5 PWRHEAD1.6 PWRHEAD1.7 PWRHEAD1.8 PWRHEAD1.9 PWRHEAD1.10 PWRHEAD1.11 PWRHEAD1.12 PWRHEAD1.13 PWRHEAD1.14 PWRHEAD1.15 PWRHEAD1.16
  Bottom 0.61: v87.78,45.92 90.02,45.92 91.03,46.94 91.03,49.78 83.82,57 PWRHEAD1.16
N$45
  Top 0.61: SJ5.2 43.48,50.8 42.67,51.61 42.67,55.68 41.2,57.15 PWRHEAD4.16
  Top 0.813: PWRHEAD4.1 PWRHEAD4.2 PWRHEAD4.3 PWRHEAD4.4 PWRHEAD4.5 PWRHEAD4.6 PWRHEAD4.7 PWRHEAD4.8 PWRHEAD4.9 PWRHEAD4.10 PWRHEAD4.11 PWRHEAD4.12 PWRHEAD4.13 PWRHEAD4.14 PWRHEAD4.15 PWRHEAD4.16
RF24_CE  (1 unrouted)
RF24_CS  (1 unrouted)
RF24_IRQ  (1 unrouted)
RST  (5 unrouted)
  Top 0.254: R48.1 C45.1
SDIO_CLK
  Top 0.254: R4.1 18.99,32.43 U6.P$5
SDIO_CMD  (via drill 0.51)  (2 unrouted)
  Top 0.254: R5.1 22.15,35.56 v22.55,35.15 | 16.56,34.54 v18.09,34.54
  Bottom 0.254: v22.55,35.15 22.55,34.34 22.15,33.93 18.69,33.93 v18.09,34.54
SDIO_D0  (via drill 0.51)
  Top 0.254: U6.P$7 19.42,30.23 R3.1 18.9,30.48 v18.09,31.29 | v53.44,24.99 60.43,31.98 U1.66
  Bottom 0.254: v18.09,31.29 18.09,31.9 18.9,32.72 36.78,32.72 46.13,23.37 51.82,23.37 v53.44,24.99
SDIO_D1  (1 unrouted)
  Top 0.254: U6.P$8 16.55,29.21 R2.1
SDIO_D2  (2 unrouted)
SDIO_D3  (2 unrouted)
SDIO_DETECT  (1 unrouted)
SPI_MISO  (1 unrouted)
SPI_MOSI  (1 unrouted)
SPI_SCK  (1 unrouted)
T0
  Top 0.254: U1.96 49.34,50.99 PINHEAD3.1
T1
  Top 0.254: U1.95 49.84,53.03 PINHEAD3.2
T2
  Top 0.254: U1.93 50.84,54.57 PINHEAD3.3
T3
  Top 0.254: U1.92 51.34,52.61 PINHEAD3.4
T4
  Top 0.254: U1.91 51.84,50.57 PINHEAD3.5
T5  (via drill 0.51)
  Top 0.254: PINHEAD3.6 56.9,53.09 v56.9,47.35 | v57.91,24.79 57.91,22.55 U1.47
  Bottom 0.254: v56.9,47.35 56.9,25.81 v57.91,24.79
T6  (via drill 0.51)
  Top 0.254: PINHEAD3.7 57.91,51.56 v57.91,46.13 | v57.91,26.21 59.13,25.6 59.13,24.59 58.34,23.8 U1.48
  Bottom 0.254: v57.91,26.21 v57.91,46.13
T7  (1 unrouted)
T8  (1 unrouted)
T9  (1 unrouted)
T10  (1 unrouted)
T11
  Top 0.254: U1.62 63.71,29.98 78.44,44.7 78.44,49.84 PINHEAD3.12
T12
  Top 0.254: U1.61 64.23,29.48 79.45,44.7 79.45,50.19 76.2,53.44 PINHEAD3.13
T13
  Top 0.254: U1.60 64.74,28.98 80.47,44.7 80.47,51 78.64,52.83 78.64,54.51 PINHEAD3.14
T14
  Top 0.254: U1.59 65.26,28.48 81.28,44.5 PINHEAD3.15
TA0  (1 unrouted)
TA1  (1 unrouted)
TA2
  Top 0.254: PINHEAD2.7 31.9,40.49 31.9,34.95 41.37,25.48 U1.23
TA3  (via drill 0.51)
  Top 0.254: v47.35,24.59 v47.34,24.58 U1.26
  Bottom 0.254: PINHEAD2.8 20.32,53.44 47.35,26.42 v47.35,24.59
TA4  (1 unrouted)
TA5  (1 unrouted)
TA6  (1 unrouted)
TA7  (1 unrouted)
TA8
  Top 0.254: U1.18 42.12,27.98 39.42,30.68 39.42,48.21 PINHEAD2.13
TA9
  Top 0.254: U1.17 42.23,28.48 39.83,30.89 39.83,50.34 PINHEAD2.14
TA10
  Top 0.254: PINHEAD2.15 38.1,54.56 40.23,52.43 40.23,31.09 42.34,28.98 U1.16
TA11
  Top 0.254: U1.15 42.45,29.48 40.64,31.29 PINHEAD2.16
USB_DISC  (1 unrouted)
  Top 0.254: PINHEAD2.4 14.83,49.94 14.83,23.16 16.41,21.59 R37.1 19.67,19.82 U$24.1
USB_DM  (1 unrouted)
  Top 0.254: U4.6 8.33,25.04 8.33,51.36 PINHEAD2.2
USB_DP  (2 unrouted)
  Top 0.254: PINHEAD2.3 13.65,48.58 U4.4
USBP3  (1 unrouted)
V+  (via drill 0.51)
  Top 0.61: 90.59,50.7 IC2.3 | 90.59,50.7 SJ4.1 | 90.59,50.7 90.59,47.72 89.61,46.74 89.61,46.33 | 89.61,46.33 89.61,45.81 C28.1 C31.2 89.52,41.14 95.91,34.75 95.91,27.43 95.1,26.62 95.1,24.92 IC1.3 95.02,10.29 92.71,7.98 C32.+ | SJ5.1 v46.53,51.61 | v71.12,51.61 71.93,51.61 v74.37,49.17 | v87.99,47.95 89.61,46.33
  Bottom 0.61: v46.53,51.61 v71.12,51.61 | v74.37,49.17 86.77,49.17 v87.99,47.95
VCC  (via drill 0.51)  (1 unrouted)
  Top 0.254: LED1.A LED2.A 33.41,19.8 33.93,20.32 34.94,20.32 | 34.94,20.32 C25.1 | 34.94,20.32 R12.1 36.37,23.02 | 36.37,23.02 36.37,27.43 35.23,28.57 U3.8 | 36.37,23.02 36.58,22.82 v36.58,21.13 | v25.4,20.52 23.48,22.44 R13.1 R11.2 R14.2 R10.2
  Bottom 0.254: v36.58,21.13 35.97,20.52 v25.4,20.52